# Altium schematic sheet Public CPU USB.schdoc
size 356 x 222 mm
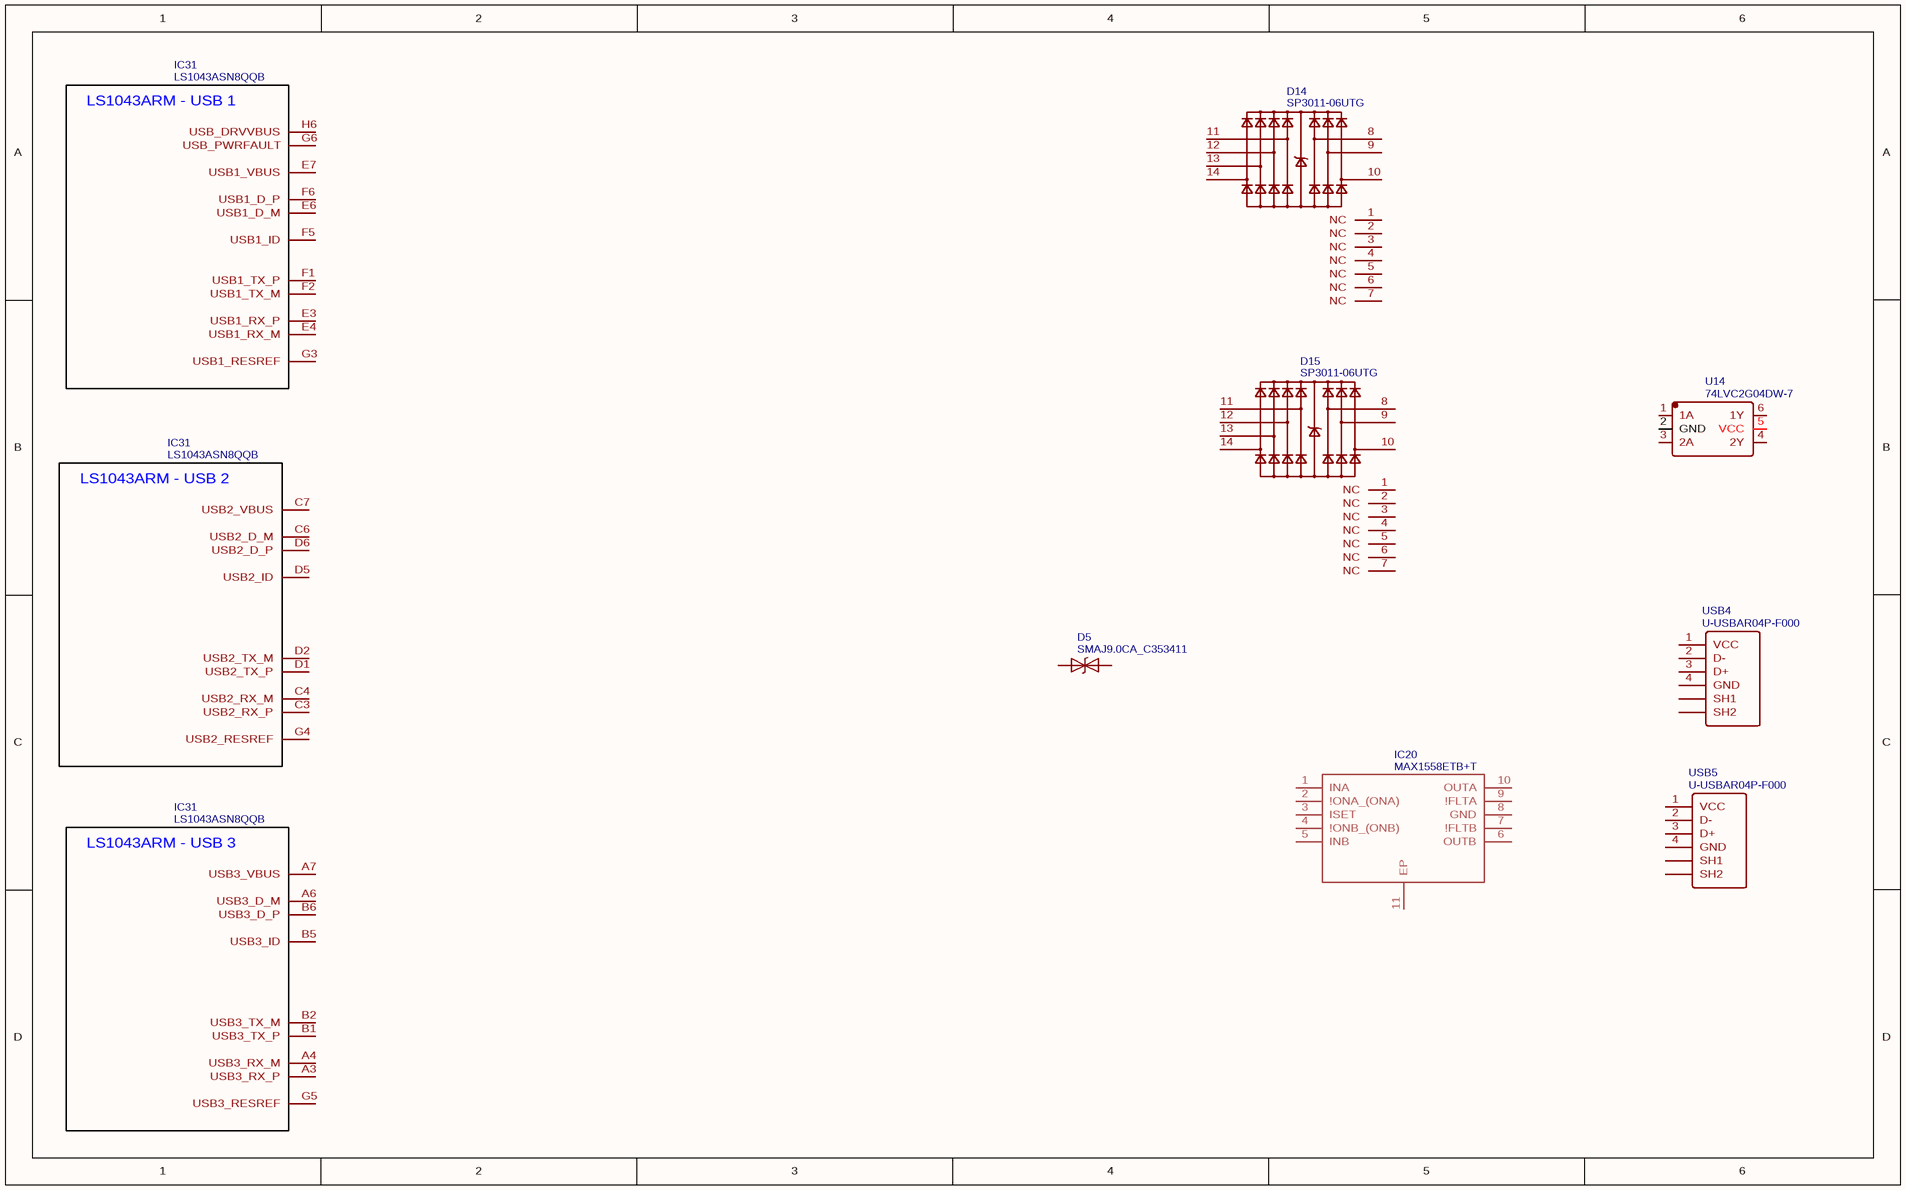
[diagram p0: Public CPU USB.schdoc]

## Parts
(Parts that share a designator on the sheet are numbered #1, #2 ... from top to bottom, then left to right.)
D5  SMAJ9.0CA_C353411  [SMA_L4.4-W2.6-LS5.0-BI]
D14  SP3011-06UTG  [UDFN-14_L3.5-W1.3-P0.50-BL]
D15  SP3011-06UTG  [UDFN-14_L3.5-W1.3-P0.50-BL]
IC20  MAX1558ETB+T  [SON50P300X300X80-11N]
IC31#1  LS1043ASN8QQB  [BGA621C65P25X25_1700X1700X218N]
IC31#2  LS1043ASN8QQB  [BGA621C65P25X25_1700X1700X218N]
IC31#3  LS1043ASN8QQB  [BGA621C65P25X25_1700X1700X218N]
U14  74LVC2G04DW-7  [SOT-363_L2.0-W1.3-P0.65-LS2.1-BL]
USB4  U-USBAR04P-F000  [USB-A-TH_USB-302-T]
USB5  U-USBAR04P-F000  [USB-A-TH_USB-302-T]

## Nets

Not connected (* = marked no-connect by the designer): D5 1 2; D14 1(NC) 2(NC) 3(NC) 4(NC) 5(NC) 6(NC) 7(NC) 8 9 10(GND) 11 12 13 14; D15 1(NC) 2(NC) 3(NC) 4(NC) 5(NC) 6(NC) 7(NC) 8 9 10(GND) 11 12 13 14; IC20 1(INA) 2(!ONA_(ONA)) 3(ISET) 4(!ONB_(ONB)) 5(INB) 6(OUTB) 7(!FLTB) 8(GND) 9(!FLTA) 10(OUTA) 11(EP); IC31#1 E3(USB1_RX_P) E4(USB1_RX_M) E6(USB1_D_M) E7(USB1_VBUS) F1(USB1_TX_P) F2(USB1_TX_M) F5(USB1_ID) F6(USB1_D_P) G3(USB1_RESREF) G6(USB_PWRFAULT) H6(USB_DRVVBUS); IC31#2 C3(USB2_RX_P) C4(USB2_RX_M) C6(USB2_D_M) C7(USB2_VBUS) D1(USB2_TX_P) D2(USB2_TX_M) D5(USB2_ID) D6(USB2_D_P) G4(USB2_RESREF); IC31#3 A3(USB3_RX_P) A4(USB3_RX_M) A6(USB3_D_M) A7(USB3_VBUS) B1(USB3_TX_P) B2(USB3_TX_M) B5(USB3_ID) B6(USB3_D_P) G5(USB3_RESREF); U14 1(1A) 2(GND) 3(2A) 4(2Y) 5(VCC) 6(1Y); USB4 1(VCC) 2(D-) 3(D+) 4(GND) 5(SH1) 6(SH2); USB5 1(VCC) 2(D-) 3(D+) 4(GND) 5(SH1) 6(SH2)

## Notes on the sheet
- (in symbol LS1043ASN8QQB) LS1043ARM - USB 1; LS1043ARM - USB 2; LS1043ARM - USB 3

## Library data of the parts
D5 = SMAJ9.0CA_C353411: BOM_Manufacturer: Shandong Jingdao Microelectronics; Contributor: LCSC; SMT Type: Extend; BOM_Supplier: LCSC; BOM_Supplier Part: C353411; BOM_Manufacturer Part: SMAJ9.0CA; BOM_LCSC Assembly: Yes; spicePre: D; spiceSymbolName: SMAJ9.0CA_C353411
D14 D15 = SP3011-06UTG: BOM_Manufacturer: Littelfuse; Contributor: LCSC; BOM_Supplier: LCSC; BOM_Supplier Part: C207281; BOM_Manufacturer Part: SP3011-06UTG; spicePre: D; spiceSymbolName: SP3011-06UTG
IC31#1-IC31#3 = LS1043ASN8QQB: subpart_no: 1; Contributor: Ke'Ondrae_Mell; spicePre: I; spiceSymbolName: LS1043ASN8QQB
U14 = 74LVC2G04DW-7: BOM_Manufacturer: Diodes Incorporated; Contributor: LCSC; SMT Type: Extend; BOM_Supplier: LCSC; BOM_Supplier Part: C69053; BOM_Manufacturer Part: 74LVC2G04DW-7; BOM_LCSC Assembly: Yes; spicePre: U; spiceSymbolName: 74LVC2G04DW-7
USB4 USB5 = U-USBAR04P-F000: BOM_Manufacturer: Shenzhen Cankemeng; Contributor: LCSC; BOM_Supplier: LCSC; BOM_Supplier Part: C386740; BOM_Manufacturer Part: U-USBAR04P-F000; spicePre: U; spiceSymbolName: U-USBAR04P-F000
IC20 = MAX1558ETB+T: spicePre: I; spiceSymbolName: MAX1558ETB+T